# EAGLE schematic EXT_TWI_LVC (EAGLE 6.5.0)
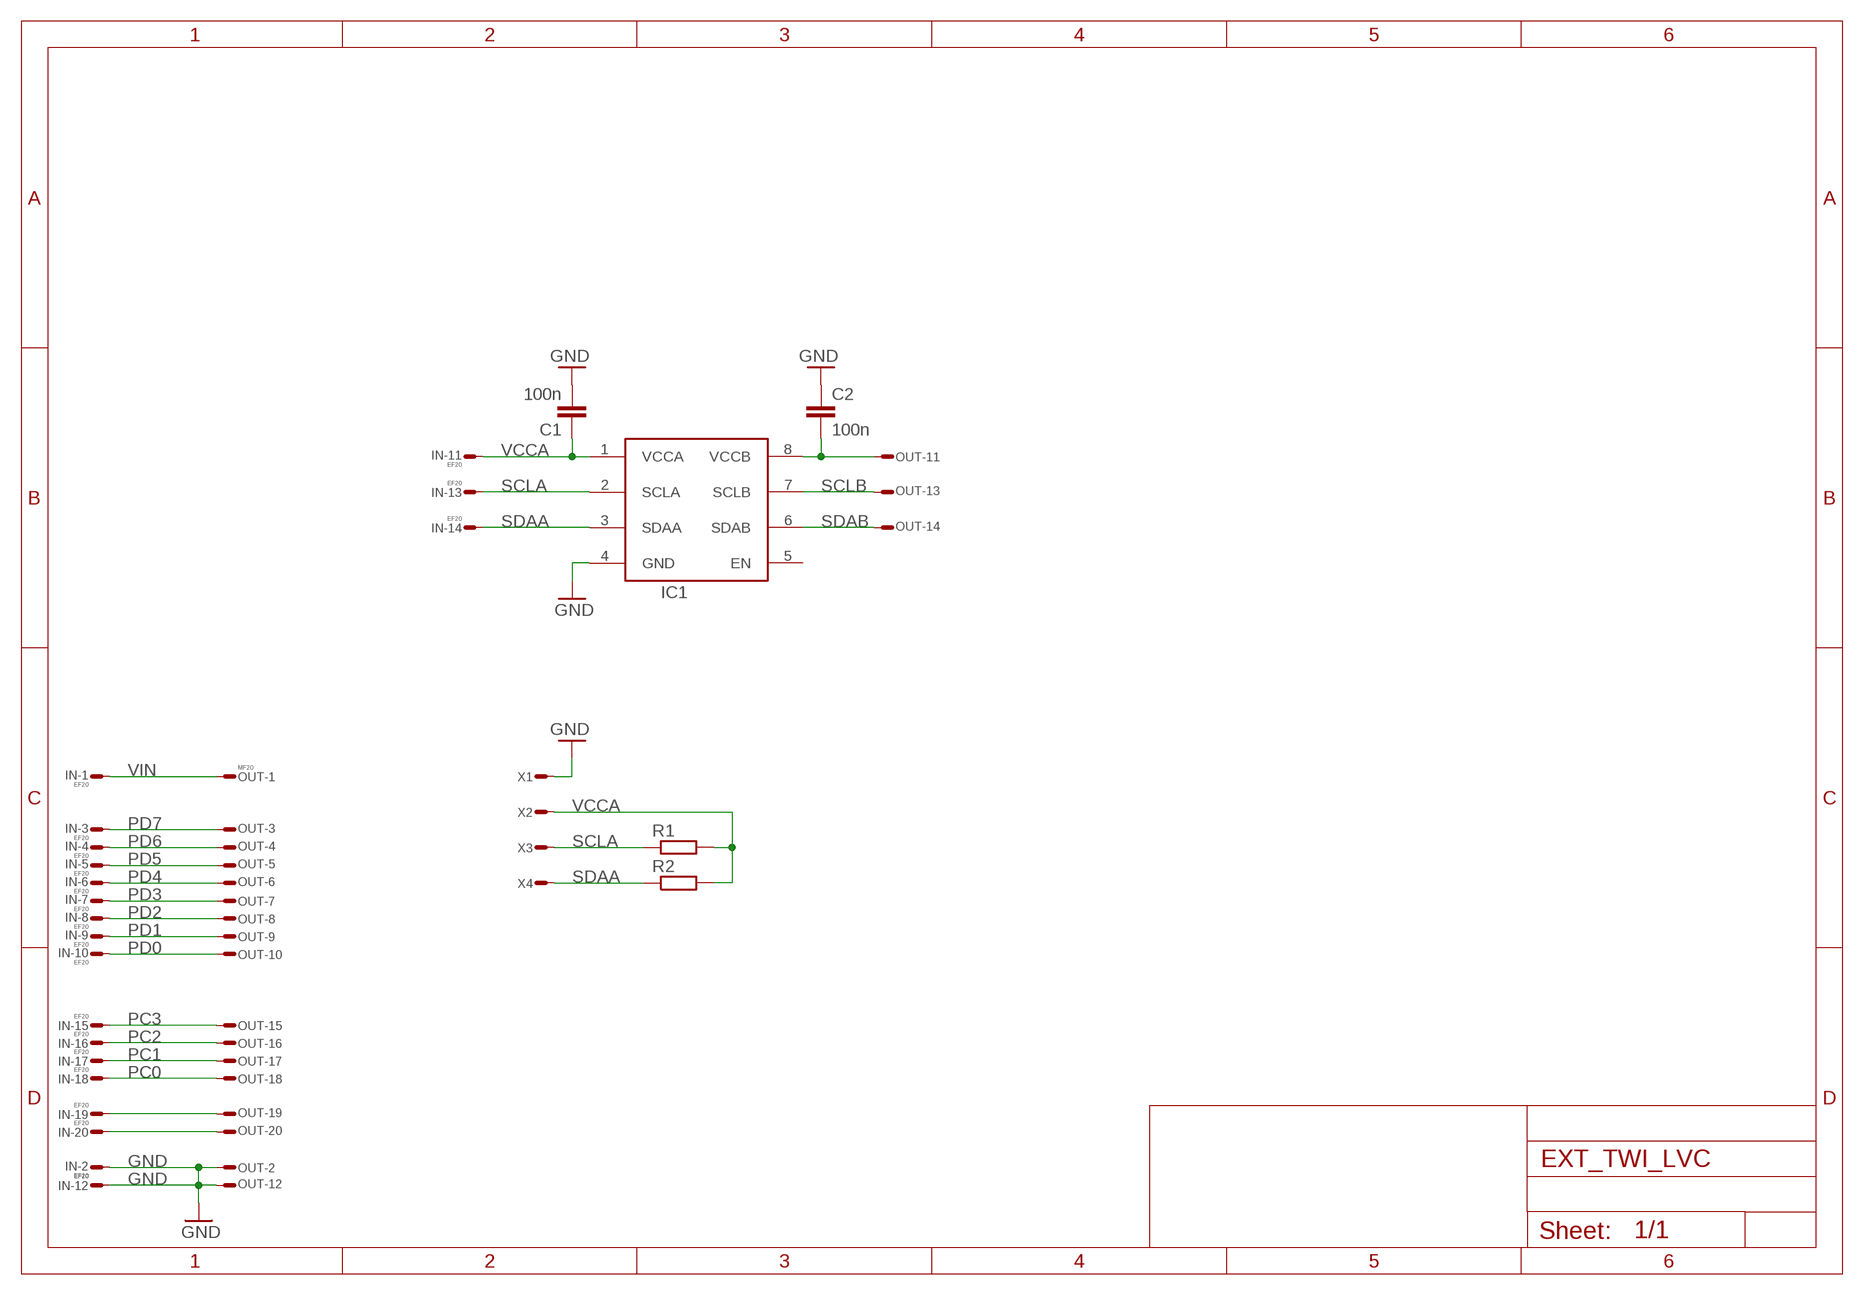
[diagram p0: schematic, sheet 1]

## Parts
C1  100n  C0603  [0603]
C2  100n  C0603  [0603]
IC1  PCA9517D  [SOIC8]
IN  EF20  FE20ELS  [FE10-2WS]
OUT  MF20  ML20LSE  [ML20LS]
R1  R0603  [0603]
R2  R0603  [0603]
X1  WIREPADT1.6/0.9  [T1.6/0.9]
X2  WIREPADT1.6/0.9  [T1.6/0.9]
X3  WIREPADT1.6/0.9  [T1.6/0.9]
X4  WIREPADT1.6/0.9  [T1.6/0.9]

## Nets
GND: C1.2 C2.1 IC1.4(GND) IN.P$2 IN.P$12 OUT.P$2 OUT.P$12 X1.1(S)
N$1: IN.P$20 OUT.P$20
N$3: IN.P$19 OUT.P$19
N$4: C2.2 IC1.8(VCCB) OUT.P$11
PC0: IN.P$18 OUT.P$18
PC1: IN.P$17 OUT.P$17
PC2: IN.P$16 OUT.P$16
PC3: IN.P$15 OUT.P$15
PD0: IN.P$10 OUT.P$10
PD1: IN.P$9 OUT.P$9
PD2: IN.P$8 OUT.P$8
PD3: IN.P$7 OUT.P$7
PD4: IN.P$6 OUT.P$6
PD5: IN.P$5 OUT.P$5
PD6: IN.P$4 OUT.P$4
PD7: IN.P$3 OUT.P$3
SCLA: IC1.2(SCLA) IN.P$13 R1.1 X3.1(S)
SCLB: IC1.7(SCLB) OUT.P$13
SDAA: IC1.3(SDAA) IN.P$14 R2.1 X4.1(S)
SDAB: IC1.6(SDAB) OUT.P$14
VCCA: C1.1 IC1.1(VCCA) IN.P$11 R1.2 R2.2 X2.1(S)
VIN: IN.P$1 OUT.P$1
Unconnected: IC1.5(EN)

## Library data of the parts
C1 C2 = RCL:C: Capacitor SMD
IC1 = Other:PCA9517
IN = Conn:FE20E
OUT = Conn:ML20?E: HARTING
R1 R2 = RCL:R: Resistor SMD
X1-X4 = Conn:WIREPAD: Wire PAD connect wire on PCB